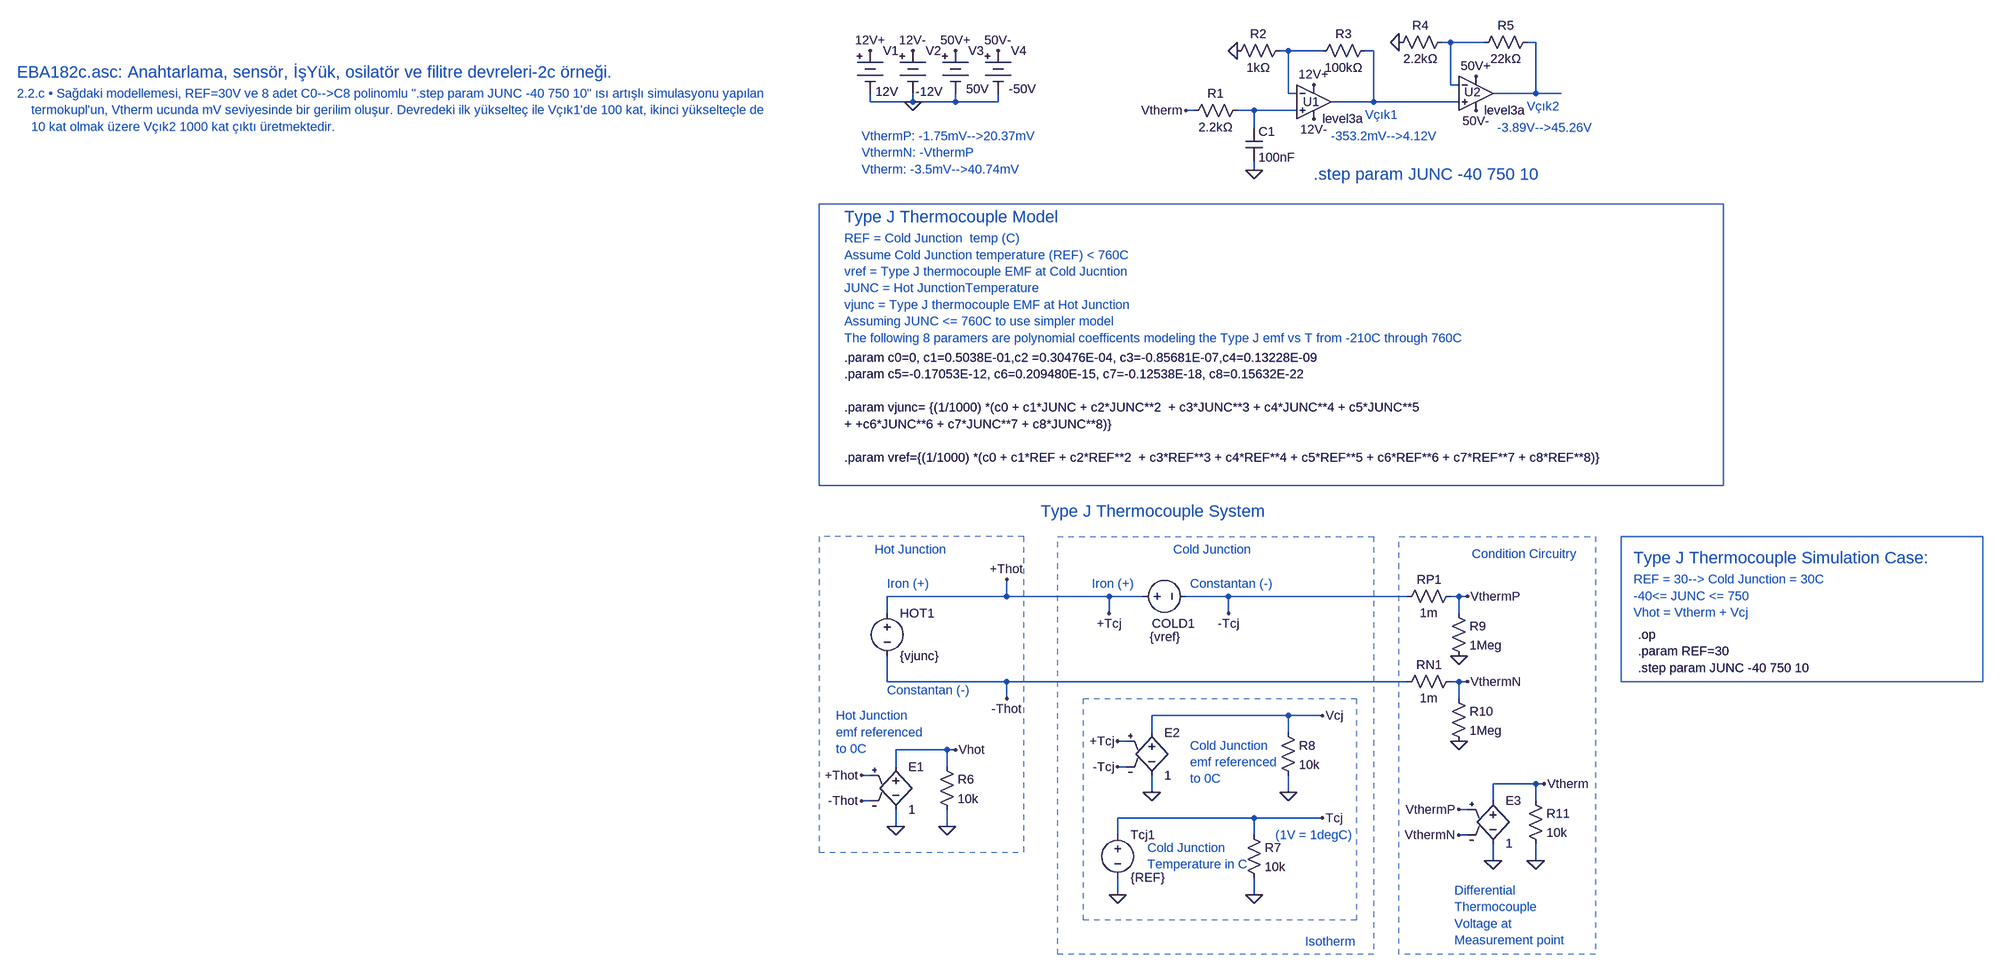
[diagram p0: schematic EBA182c.asc]
EBA182c.asc, the LTspice schematic file:
Version 4
SHEET 1 7064 4332
WIRE 2656 0 2640 0
WIRE 2720 0 2656 0
WIRE 2816 0 2800 0
WIRE 2352 16 2336 16
WIRE 2416 16 2352 16
WIRE 2512 16 2496 16
WIRE 2656 80 2656 0
WIRE 2672 80 2656 80
WIRE 2352 96 2352 16
WIRE 2368 96 2352 96
WIRE 2816 96 2816 0
WIRE 2816 96 2736 96
WIRE 2864 96 2816 96
WIRE 1568 112 1568 96
WIRE 1648 112 1648 96
WIRE 1648 112 1568 112
WIRE 1728 112 1728 96
WIRE 1728 112 1648 112
WIRE 1808 112 1808 96
WIRE 1808 112 1728 112
WIRE 2512 112 2512 16
WIRE 2512 112 2432 112
WIRE 2672 112 2512 112
WIRE 2176 128 2160 128
WIRE 2288 128 2256 128
WIRE 2368 128 2288 128
WIRE 2288 160 2288 128
WIRE 2288 240 2288 224
WIRE 1824 1040 1824 1008
WIRE 1824 1040 1600 1040
WIRE 2016 1040 1824 1040
WIRE 2080 1040 2016 1040
WIRE 2240 1040 2160 1040
WIRE 2576 1040 2240 1040
WIRE 2672 1040 2656 1040
WIRE 2688 1040 2672 1040
WIRE 1600 1072 1600 1040
WIRE 2016 1072 2016 1040
WIRE 2240 1072 2240 1040
WIRE 2672 1072 2672 1040
WIRE 1600 1200 1600 1152
WIRE 1824 1200 1600 1200
WIRE 2576 1200 1824 1200
WIRE 2672 1200 2656 1200
WIRE 2688 1200 2672 1200
WIRE 1824 1232 1824 1200
WIRE 2672 1232 2672 1200
WIRE 2352 1264 2096 1264
WIRE 2416 1264 2352 1264
WIRE 2096 1296 2096 1264
WIRE 2352 1296 2352 1264
WIRE 2048 1312 2032 1312
WIRE 1712 1328 1616 1328
WIRE 1728 1328 1712 1328
WIRE 1616 1360 1616 1328
WIRE 1712 1360 1712 1328
WIRE 2048 1360 2032 1360
WIRE 1568 1376 1552 1376
WIRE 2816 1392 2736 1392
WIRE 2832 1392 2816 1392
WIRE 2096 1408 2096 1376
WIRE 2352 1408 2352 1376
WIRE 1568 1424 1552 1424
WIRE 2736 1424 2736 1392
WIRE 2816 1424 2816 1392
WIRE 2688 1440 2672 1440
WIRE 2288 1456 2032 1456
WIRE 2416 1456 2288 1456
WIRE 1616 1472 1616 1440
WIRE 1712 1472 1712 1440
WIRE 2032 1488 2032 1456
WIRE 2288 1488 2288 1456
WIRE 2688 1488 2672 1488
WIRE 2736 1536 2736 1504
WIRE 2816 1536 2816 1504
WIRE 2032 1600 2032 1568
WIRE 2288 1600 2288 1568
FLAG 1568 16 12V+
FLAG 1648 112 0
FLAG 2400 80 12V+
FLAG 2256 16 0
FLAG 2560 0 0
FLAG 2288 240 0
FLAG 1616 1472 0
FLAG 1712 1472 0
FLAG 1552 1376 +Thot
FLAG 1552 1424 -Thot
FLAG 1728 1328 Vhot
FLAG 2016 1072 +Tcj
FLAG 2240 1072 -Tcj
FLAG 2096 1408 0
FLAG 2032 1312 +Tcj
FLAG 2032 1360 -Tcj
FLAG 2032 1600 0
FLAG 2288 1600 0
FLAG 2352 1408 0
FLAG 2416 1264 Vcj
FLAG 2416 1456 Tcj
FLAG 1824 1008 +Thot
FLAG 1824 1232 -Thot
FLAG 2688 1040 VthermP
FLAG 2688 1200 VthermN
FLAG 2672 1312 0
FLAG 2672 1152 0
FLAG 2736 1536 0
FLAG 2816 1536 0
FLAG 2832 1392 Vtherm
FLAG 2672 1440 VthermP
FLAG 2672 1488 VthermN
FLAG 2160 128 Vtherm
FLAG 1648 16 12V-
FLAG 1728 16 50V+
FLAG 1808 16 50V-
FLAG 2400 144 12V-
FLAG 2704 64 50V+
FLAG 2704 128 50V-
SYMBOL Misc\\battery 1568 0 R0
WINDOW 3 10 93 Left 2
SYMATTR Value 12V
SYMATTR InstName V1
SYMBOL OpAmps\\UniversalOpAmp3 2400 112 R0
WINDOW 0 -20 0 Left 2
SYMATTR InstName U1
SYMBOL res 2272 112 R90
WINDOW 0 0 56 VBottom 2
WINDOW 3 32 56 VTop 2
SYMATTR InstName R1
SYMATTR Value 2.2kΩ
SYMBOL cap 2272 160 R0
SYMATTR InstName C1
SYMATTR Value 100nF
SYMBOL res 2352 0 R90
WINDOW 0 0 56 VBottom 2
WINDOW 3 32 56 VTop 2
SYMATTR InstName R2
SYMATTR Value 1kΩ
SYMBOL res 2512 0 R90
WINDOW 0 0 56 VBottom 2
WINDOW 3 32 56 VTop 2
SYMATTR InstName R3
SYMATTR Value 100kΩ
SYMBOL OpAmps\\UniversalOpAmp3 2704 96 R0
WINDOW 0 -22 -2 Left 2
SYMATTR InstName U2
SYMBOL res 2656 -16 R90
WINDOW 0 0 56 VBottom 2
WINDOW 3 32 56 VTop 2
SYMATTR InstName R4
SYMATTR Value 2.2kΩ
SYMBOL res 2816 -16 R90
WINDOW 0 0 56 VBottom 2
WINDOW 3 32 56 VTop 2
SYMATTR InstName R5
SYMATTR Value 22kΩ
SYMBOL voltage 1600 1056 R0
WINDOW 123 0 0 Left 0
WINDOW 39 0 0 Left 0
SYMATTR InstName HOT1
SYMATTR Value {vjunc}
SYMBOL voltage 2064 1040 R270
WINDOW 123 0 0 Left 0
WINDOW 39 0 0 Left 0
WINDOW 0 -51 32 VRight 2
WINDOW 3 -76 28 VRight 2
SYMATTR InstName COLD1
SYMATTR Value {vref}
SYMBOL e 1616 1344 R0
SYMATTR InstName E1
SYMATTR Value 1
SYMBOL res 1696 1344 R0
SYMATTR InstName R6
SYMATTR Value 10k
SYMBOL e 2096 1280 R0
SYMATTR InstName E2
SYMATTR Value 1
SYMBOL voltage 2032 1472 R0
WINDOW 123 0 0 Left 0
WINDOW 39 0 0 Left 0
SYMATTR InstName Tcj1
SYMATTR Value {REF}
SYMBOL res 2272 1472 R0
SYMATTR InstName R7
SYMATTR Value 10k
SYMBOL res 2336 1280 R0
SYMATTR InstName R8
SYMATTR Value 10k
SYMBOL res 2672 1184 R90
WINDOW 0 0 56 VBottom 2
WINDOW 3 32 56 VTop 2
SYMATTR InstName RN1
SYMATTR Value 1m
SYMBOL res 2672 1024 R90
WINDOW 0 0 56 VBottom 2
WINDOW 3 32 56 VTop 2
SYMATTR InstName RP1
SYMATTR Value 1m
SYMBOL res 2656 1056 R0
SYMATTR InstName R9
SYMATTR Value 1Meg
SYMBOL res 2656 1216 R0
SYMATTR InstName R10
SYMATTR Value 1Meg
SYMBOL e 2736 1408 R0
SYMATTR InstName E3
SYMATTR Value 1
SYMBOL res 2800 1408 R0
SYMATTR InstName R11
SYMATTR Value 10k
SYMBOL Misc\\battery 1648 0 R0
WINDOW 3 5 93 Left 2
SYMATTR Value -12V
SYMATTR InstName V2
SYMBOL Misc\\battery 1728 0 R0
WINDOW 3 20 88 Left 2
SYMATTR Value 50V
SYMATTR InstName V3
SYMBOL Misc\\battery 1808 0 R0
WINDOW 3 20 88 Left 2
SYMATTR Value -50V
SYMATTR InstName V4
TEXT -232 56 Left 3 ;EBA182c.asc: Anahtarlama, sensör, İşYük, osilatör ve filitre devreleri-2c örneği.
TEXT -232 96 Left 2 ;2.2.c • Sağdaki modellemesi, REF=30V ve 8 adet C0-->C8 polinomlu ".step param JUNC -40 750 10" ısı artışlı simulasyonu yapılan\n    termokupl'un, Vtherm ucunda mV seviyesinde bir gerilim oluşur. Devredeki ilk yükselteç ile Vçık1'de 100 kat, ikinci yükselteçle de\n    10 kat olmak üzere Vçık2 1000 kat çıktı üretmektedir.
TEXT 1520 592 Left 2 !.param c0=0, c1=0.5038E-01,c2 =0.30476E-04, c3=-0.85681E-07,c4=0.13228E-09\n.param c5=-0.17053E-12, c6=0.209480E-15, c7=-0.12538E-18, c8=0.15632E-22\n \n.param vjunc= {(1/1000) *(c0 + c1*JUNC + c2*JUNC**2  + c3*JUNC**3 + c4*JUNC**4 + c5*JUNC**5 \n+ +c6*JUNC**6 + c7*JUNC**7 + c8*JUNC**8)}\n \n.param vref={(1/1000) *(c0 + c1*REF + c2*REF**2  + c3*REF**3 + c4*REF**4 + c5*REF**5 + c6*REF**6 + c7*REF**7 + c8*REF**8)}
TEXT 1888 880 Left 3 ;Type J Thermocouple System
TEXT 2384 1688 Left 2 ;Isotherm
TEXT 3008 1112 Left 2 !.op\n.param REF=30\n.step param JUNC -40 750 10
TEXT 2136 952 Left 2 ;Cold Junction
TEXT 1576 952 Left 2 ;Hot Junction
TEXT 2168 1320 Left 2 ;Cold Junction\nemf referenced\nto 0C
TEXT 2696 960 Left 2 ;Condition Circuitry
TEXT 3000 1008 Left 2 ;REF = 30--> Cold Junction = 30C\n-40<= JUNC <= 750 \nVhot = Vtherm + Vcj
TEXT 1600 1016 Left 2 ;Iron (+)
TEXT 1600 1216 Left 2 ;Constantan (-)
TEXT 1984 1016 Left 2 ;Iron (+)
TEXT 2168 1016 Left 2 ;Constantan (-)
TEXT 1520 368 Left 2 ;REF = Cold Junction  temp (C) \nAssume Cold Junction temperature (REF) < 760C\nvref = Type J thermocouple EMF at Cold Jucntion\nJUNC = Hot JunctionTemperature\nvjunc = Type J thermocouple EMF at Hot Junction\nAssuming JUNC <= 760C to use simpler model\nThe following 8 paramers are polynomial coefficents modeling the Type J emf vs T from -210C through 760C
TEXT 2328 1488 Left 2 ;(1V = 1degC)
TEXT 1520 328 Left 3 ;Type J Thermocouple Model
TEXT 3000 968 Left 3 ;Type J Thermocouple Simulation Case:
TEXT 2088 1512 Left 2 ;Cold Junction\nTemperature in C
TEXT 1504 1264 Left 2 ;Hot Junction\nemf referenced\nto 0C
TEXT 2664 1592 Left 2 ;Differential\nThermocouple\nVoltage at\nMeasurement point
TEXT 2800 120 Left 2 ;Vçık2
TEXT 2496 136 Left 2 ;Vçık1
TEXT 2400 248 Left 3 ;.step param JUNC -40 750 10
TEXT 1552 176 Left 2 ;VthermP: -1.75mV-->20.37mV\nVthermN: -VthermP\nVtherm: -3.5mV-->40.74mV
TEXT 2432 176 Left 2 ;-353.2mV-->4.12V
TEXT 2744 160 Left 2 ;-3.89V-->45.26V
RECTANGLE Normal 2480 1648 1968 1232 1
RECTANGLE Normal 2512 1712 1920 928 4
RECTANGLE Normal 1472 1520 1856 928 4
RECTANGLE Normal 2928 1712 2560 928 4
RECTANGLE Normal 3680 1200 2976 928
RECTANGLE Normal 3168 832 1472 304

The netlist it stands for:
* EBA182c.asc
V1 12V+ 0 12V
XU1 N005 N003 12V+ 12V- N004 level3a  ; pins In+ In- V+ V- OUT
R1 N005 Vtherm 2.2kΩ
C1 N005 0 100nF
R2 N003 0 1kΩ
R3 N004 N003 100kΩ
XU2 N004 N001 50V+ 50V- N002 level3a  ; pins In+ In- V+ V- OUT
R4 N001 0 2.2kΩ
R5 N002 N001 22kΩ
V§HOT1 +Tcj -Thot {vjunc}
V§COLD1 +Tcj -Tcj {vref}
E1 Vhot 0 +Tcj -Thot 1
R6 Vhot 0 10k
E2 Vcj 0 +Tcj -Tcj 1
V§Tcj1 Tcj 0 {REF}
R7 Tcj 0 10k
R8 Vcj 0 10k
RN1 VthermN -Thot 1m
RP1 VthermP -Tcj 1m
R9 VthermP 0 1Meg
R10 VthermN 0 1Meg
E3 Vtherm 0 VthermP VthermN 1
R11 Vtherm 0 10k
V2 12V- 0 -12V
V3 50V+ 0 50V
V4 50V- 0 -50V
* EBA182c.asc: Anahtarlama, sensör, İşYük, osilatör ve filitre devreleri-2c örneği.
* 2.2.c • Sağdaki modellemesi, REF=30V ve 8 adet C0-->C8 polinomlu ".step param JUNC -40 750 10" ısı artışlı simulasyonu yapılan
*     termokupl'un, Vtherm ucunda mV seviyesinde bir gerilim oluşur. Devredeki ilk yükselteç ile Vçık1'de 100 kat, ikinci yükselteçle de
*     10 kat olmak üzere Vçık2 1000 kat çıktı üretmektedir.
.param c0=0, c1=0.5038E-01,c2 =0.30476E-04, c3=-0.85681E-07,c4=0.13228E-09
.param c5=-0.17053E-12, c6=0.209480E-15, c7=-0.12538E-18, c8=0.15632E-22
.param vjunc= {(1/1000) *(c0 + c1*JUNC + c2*JUNC**2  + c3*JUNC**3 + c4*JUNC**4 + c5*JUNC**5
+ +c6*JUNC**6 + c7*JUNC**7 + c8*JUNC**8)}
.param vref={(1/1000) *(c0 + c1*REF + c2*REF**2  + c3*REF**3 + c4*REF**4 + c5*REF**5 + c6*REF**6 + c7*REF**7 + c8*REF**8)}
* Type J Thermocouple System
* Isotherm
.op
.param REF=30
.step param JUNC -40 750 10
* Cold Junction
* Hot Junction
* Cold Junction
* emf referenced
* to 0C
* Condition Circuitry
* REF = 30--> Cold Junction = 30C
* -40<= JUNC <= 750
* Vhot = Vtherm + Vcj
* Iron (+)
* Constantan (-)
* Iron (+)
* Constantan (-)
* REF = Cold Junction  temp (C)
* Assume Cold Junction temperature (REF) < 760C
* vref = Type J thermocouple EMF at Cold Jucntion
* JUNC = Hot JunctionTemperature
* vjunc = Type J thermocouple EMF at Hot Junction
* Assuming JUNC <= 760C to use simpler model
* The following 8 paramers are polynomial coefficents modeling the Type J emf vs T from -210C through 760C
* (1V = 1degC)
* Type J Thermocouple Model
* Type J Thermocouple Simulation Case:
* Cold Junction
* Temperature in C
* Hot Junction
* emf referenced
* to 0C
* Differential
* Thermocouple
* Voltage at
* Measurement point
* Vçık2
* Vçık1
* .step param JUNC -40 750 10
* VthermP: -1.75mV-->20.37mV
* VthermN: -VthermP
* Vtherm: -3.5mV-->40.74mV
* -353.2mV-->4.12V
* -3.89V-->45.26V
.backanno
.end